# Altium schematic sheet Z80_Interface.SchDoc: Z80 Interface
size Tabloid; Date: 08/05/2023; Engineer: Terry D. Schevker; Revision: 1.0; SheetNumber: 8; SheetTotal: 8
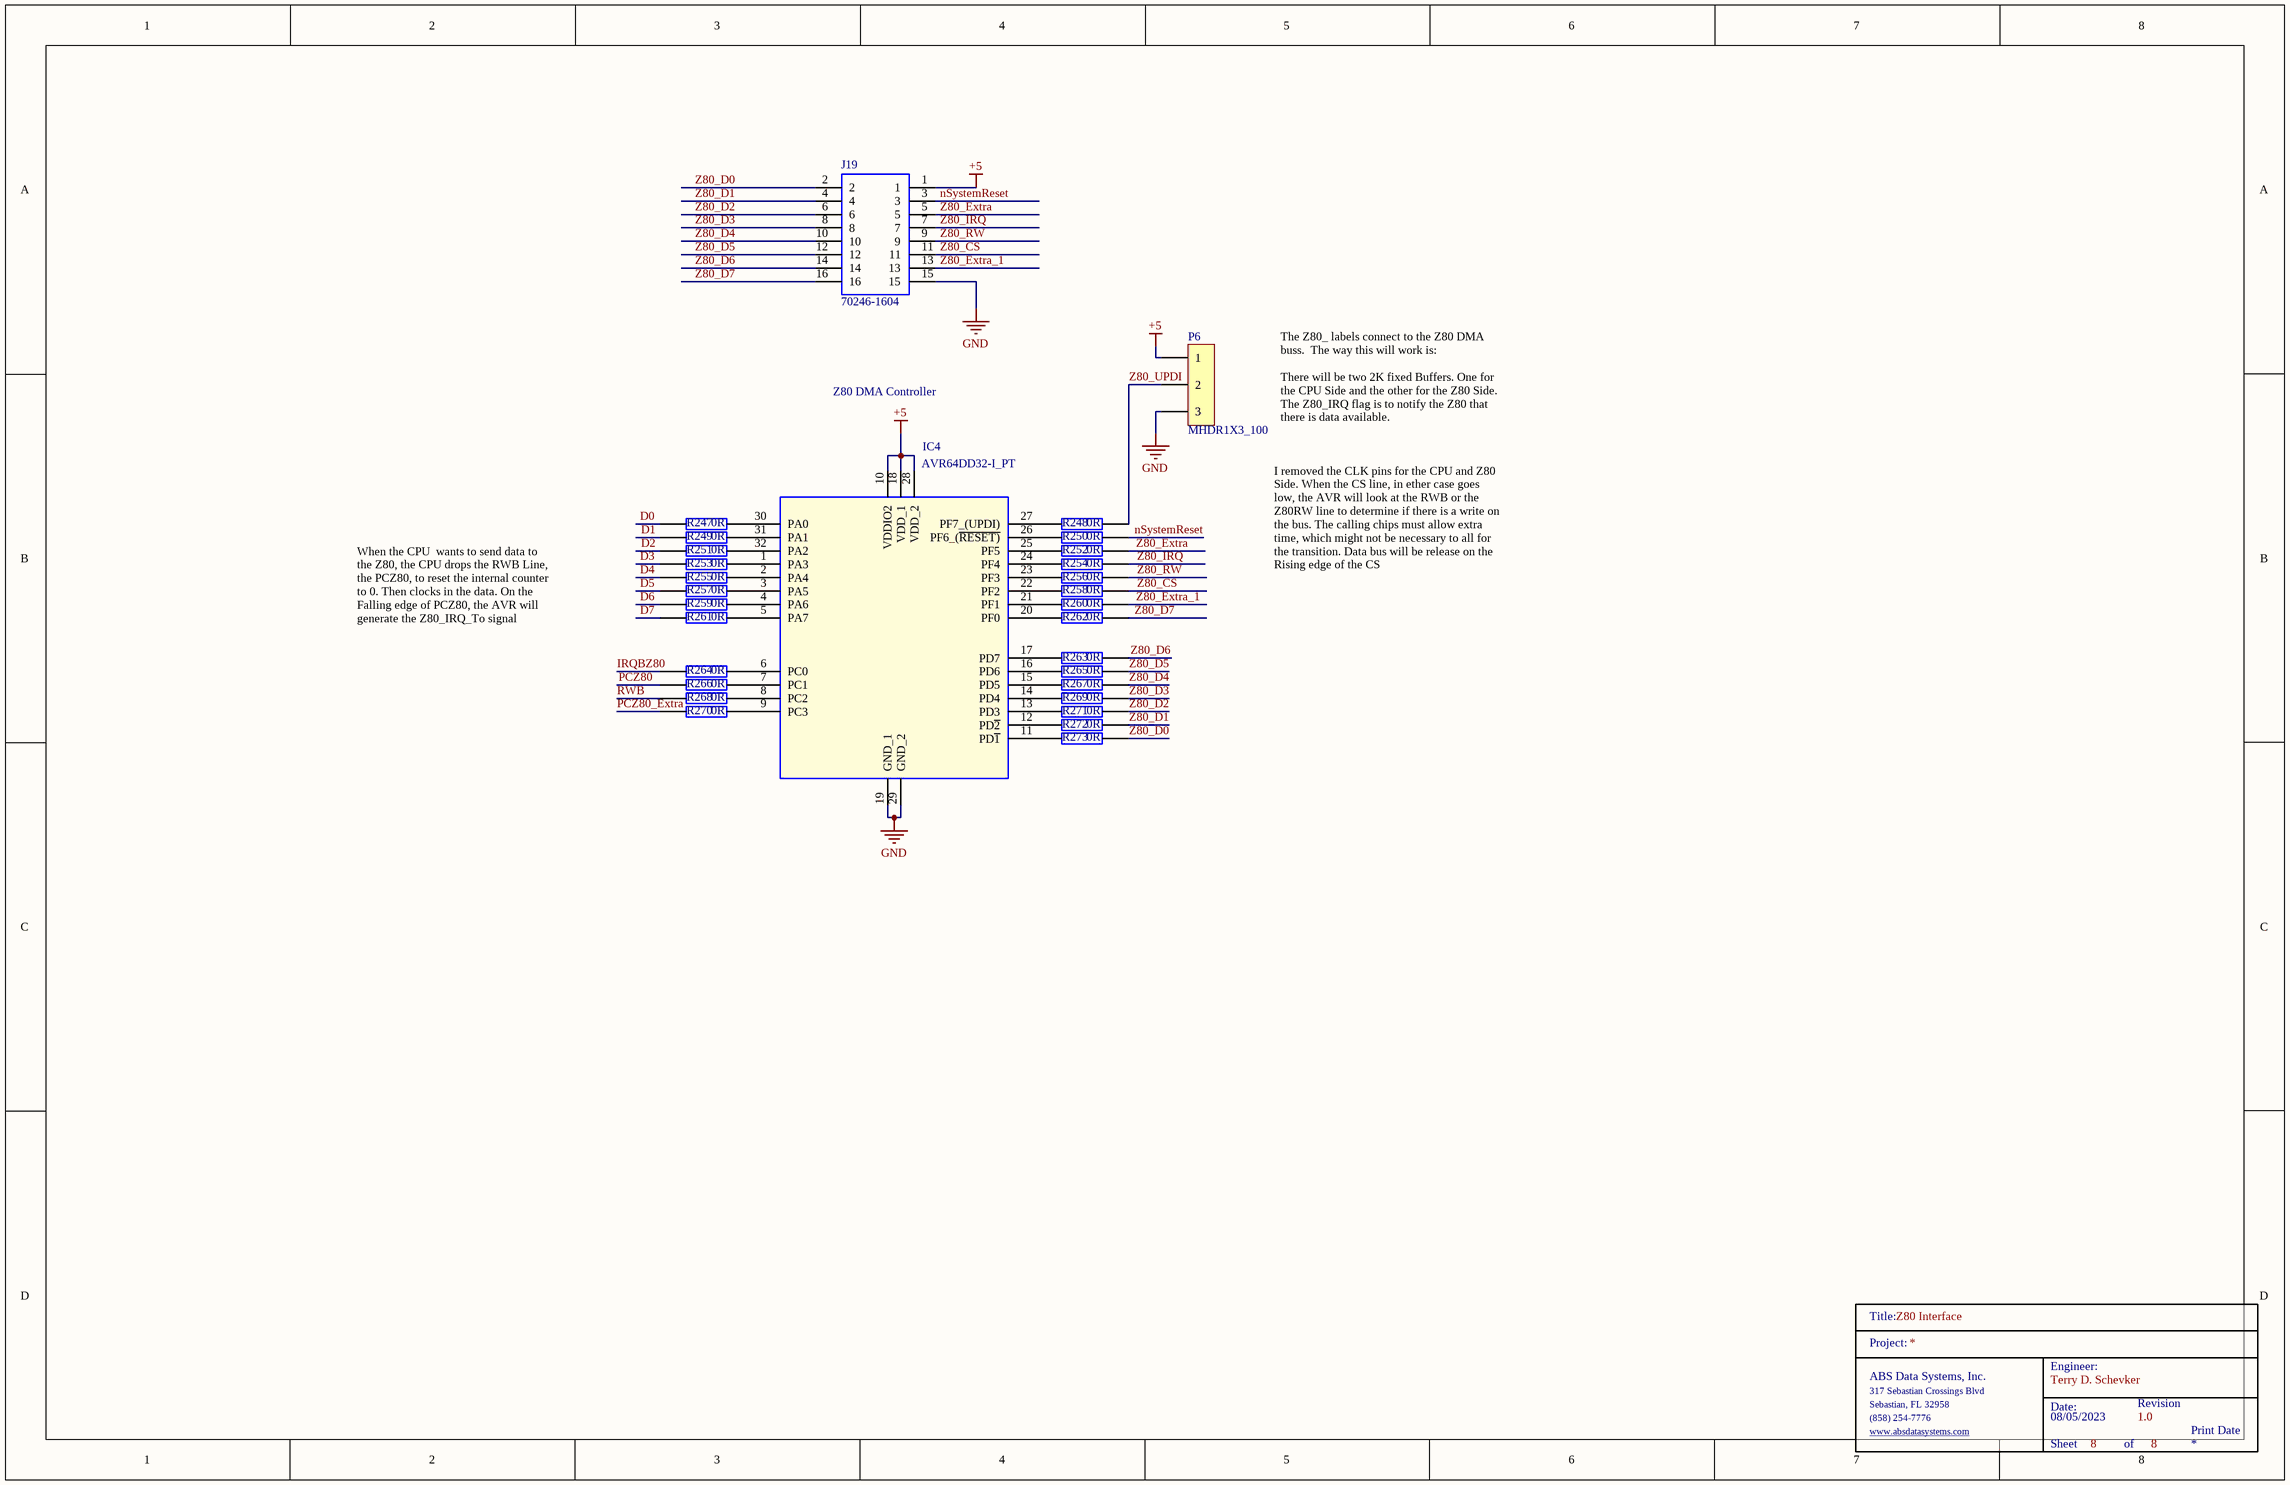
[diagram p0: Z80_Interface.SchDoc]

## Parts
IC4  AVR64DD32-I_PT  [QFP80P900X900X120-32N]
J19  70246-1604  [SHDR16W99P254_2X8_2794X889X927P]
P6  MHDR1X3_100  [MHDR1X3_100]
R247  0R  [0603]
R248  0R  [0603]
R249  0R  [0603]
R250  0R  [0603]
R251  0R  [0603]
R252  0R  [0603]
R253  0R  [0603]
R254  0R  [0603]
R255  0R  [0603]
R256  0R  [0603]
R257  0R  [0603]
R258  0R  [0603]
R259  0R  [0603]
R260  0R  [0603]
R261  0R  [0603]
R262  0R  [0603]
R263  0R  [0603]
R264  0R  [0603]
R265  0R  [0603]
R266  0R  [0603]
R267  0R  [0603]
R268  0R  [0603]
R269  0R  [0603]
R270  0R  [0603]
R271  0R  [0603]
R272  0R  [0603]
R273  0R  [0603]
TitleBlock_6  TitleBlock  (value not drawn)  (graphical)

## Nets
+5: IC4.10(VDDIO2) IC4.18(VDD_1) IC4.28(VDD_2) J19.1 P6.1
GND: IC4.19(GND_1) IC4.29(GND_2) J19.15 P6.3
D0: R247.1
D1: R249.1
D2: R251.1
D3: R253.1
D4: R255.1
D5: R257.1
D6: R259.1
D7: R261.1
IRQBZ80: R264.1
nSystemReset: J19.3 R250.2
PCZ80: R266.1
PCZ80_Extra: R270.1
RWB: R268.1
Z80_CS: J19.11 R258.2
Z80_D0: J19.2 R273.2
Z80_D1: J19.4 R272.2
Z80_D2: J19.6 R271.2
Z80_D3: J19.8 R269.2
Z80_D4: J19.10 R267.2
Z80_D5: J19.12 R265.2
Z80_D6: J19.14 R263.2
Z80_D7: J19.16 R262.2
Z80_Extra: J19.5 R252.2
Z80_Extra_1: J19.13 R260.2
Z80_IRQ: J19.7 R254.2
Z80_RW: J19.9 R256.2
Z80_UPDI: P6.2 R248.2
NetIC4_1: IC4.1(PA3) R253.2
NetIC4_2: IC4.2(PA4) R255.2
NetIC4_3: IC4.3(PA5) R257.2
NetIC4_4: IC4.4(PA6) R259.2
NetIC4_5: IC4.5(PA7) R261.2
NetIC4_6: IC4.6(PC0) R264.2
NetIC4_7: IC4.7(PC1) R266.2
NetIC4_8: IC4.8(PC2) R268.2
NetIC4_9: IC4.9(PC3) R270.2
NetIC4_11: IC4.11(PD~{1}) R273.1
NetIC4_12: IC4.12(PD~{2}) R272.1
NetIC4_13: IC4.13(PD3) R271.1
NetIC4_14: IC4.14(PD4) R269.1
NetIC4_15: IC4.15(PD5) R267.1
NetIC4_16: IC4.16(PD6) R265.1
NetIC4_17: IC4.17(PD7) R263.1
NetIC4_20: IC4.20(PF0) R262.1
NetIC4_21: IC4.21(PF1) R260.1
NetIC4_22: IC4.22(PF2) R258.1
NetIC4_23: IC4.23(PF3) R256.1
NetIC4_24: IC4.24(PF4) R254.1
NetIC4_25: IC4.25(PF5) R252.1
NetIC4_26: IC4.26(PF6_(~{RESET)}) R250.1
NetIC4_27: IC4.27(PF7_(UPDI)) R248.1
NetIC4_30: IC4.30(PA0) R247.2
NetIC4_31: IC4.31(PA1) R249.2
NetIC4_32: IC4.32(PA2) R251.2

## Notes on the sheet
- The Z80_ labels connect to the Z80 DMA buss.  The way this will work is:
- Z80 DMA Controller
- There will be two 2K fixed Buffers. One for the CPU Side and the other for the Z80 Side. The Z80_IRQ flag is to notify the Z80 that there is data available.
- When the CPU  wants to send data to the Z80, the CPU drops the RWB Line, the PCZ80, to reset the internal counter to 0. Then clocks in the data. On the Falling edge of PCZ80, the AVR will generate the Z80_IRQ_To signal
- I removed the CLK pins for the CPU and Z80 Side. When the CS line, in ether case goes low, the AVR will look at the RWB or the Z80RW line to determine if there is a write on the bus. The calling chips must allow extra time, which might not be necessary to all for the transition. Data bus will be release on the Rising edge of the CS
- Print Date
- (in symbol TitleBlock) Title:; Project:; Engineer:; ABS Data Systems, Inc.; 317 Sebastian Crossings Blvd; Sebastian, FL 32958; Date:; Revision; (858) 254-7776; www.absdatasystems.com; Sheet; of

## Library data of the parts
IC4 = AVR64DD32-I_PT: Integrated Circuit; Manufacturer_Name: Microchip; Manufacturer_Part_Number: AVR64DD32-I/PT | MULTI-VOLTAGE I/O; Datasheet Link: https://www.microchip.com/en-us/product/AVR64DD32; Height: 1.2mm
J19 = 70246-1604: Molex C-GRID 70246, 2.54mm Pitch, 16 Way, 2 Row, Straight PCB Header, Through Hole; Geometry.Height: 9.27mm; Mouser Part Number: 538-70246-1604; Mouser Price/Stock: https://www.mouser.co.uk/ProductDetail/Molex/70246-1604?qs=KUIzHt%2Fe91njhb67Cjmalw%3D%3D; Manufacturer_Name: Molex; Manufacturer_Part_Number: 70246-1604; Datasheet Link: https://www.molex.com/pdm_docs/sd/702461604_sd.pdf
P6 = MHDR1X3_100: Header, 3-Pin; LatestRevisionDate: 17-Jul-2002; LatestRevisionNote: Re-released for DXP Platform.; Publisher: Altium Limited
R247-R273 = RC0603JR-070RL: YAGEO 0603 0 ohm; Manufacturer_Name: KEMET; Geometry.Height: 0.55mm; Mouser Part Number: 603-RC0603JR-070RL; Mouser Price/Stock: https://www.mouser.co.uk/ProductDetail/YAGEO/RC0603JR-070RL?qs=2cAdsCoAWRGWyPcuXgGiXQ%3D%3D; Manufacturer_Part_Number: RC0603JR-070RL; Datasheet Link: https://datasheet.datasheetarchive.com/originals/distributors/Datasheets_SAMA/902f9e387b938f871d31120f5fc1d65e.pdf